# Altium project MASTER_HW.PrjPcb (part 3 of 3)

## Sheet [6] TSAL.SchDoc
size A4; DocumentNumber: 8; SheetNumber: 9; SheetTotal: 10
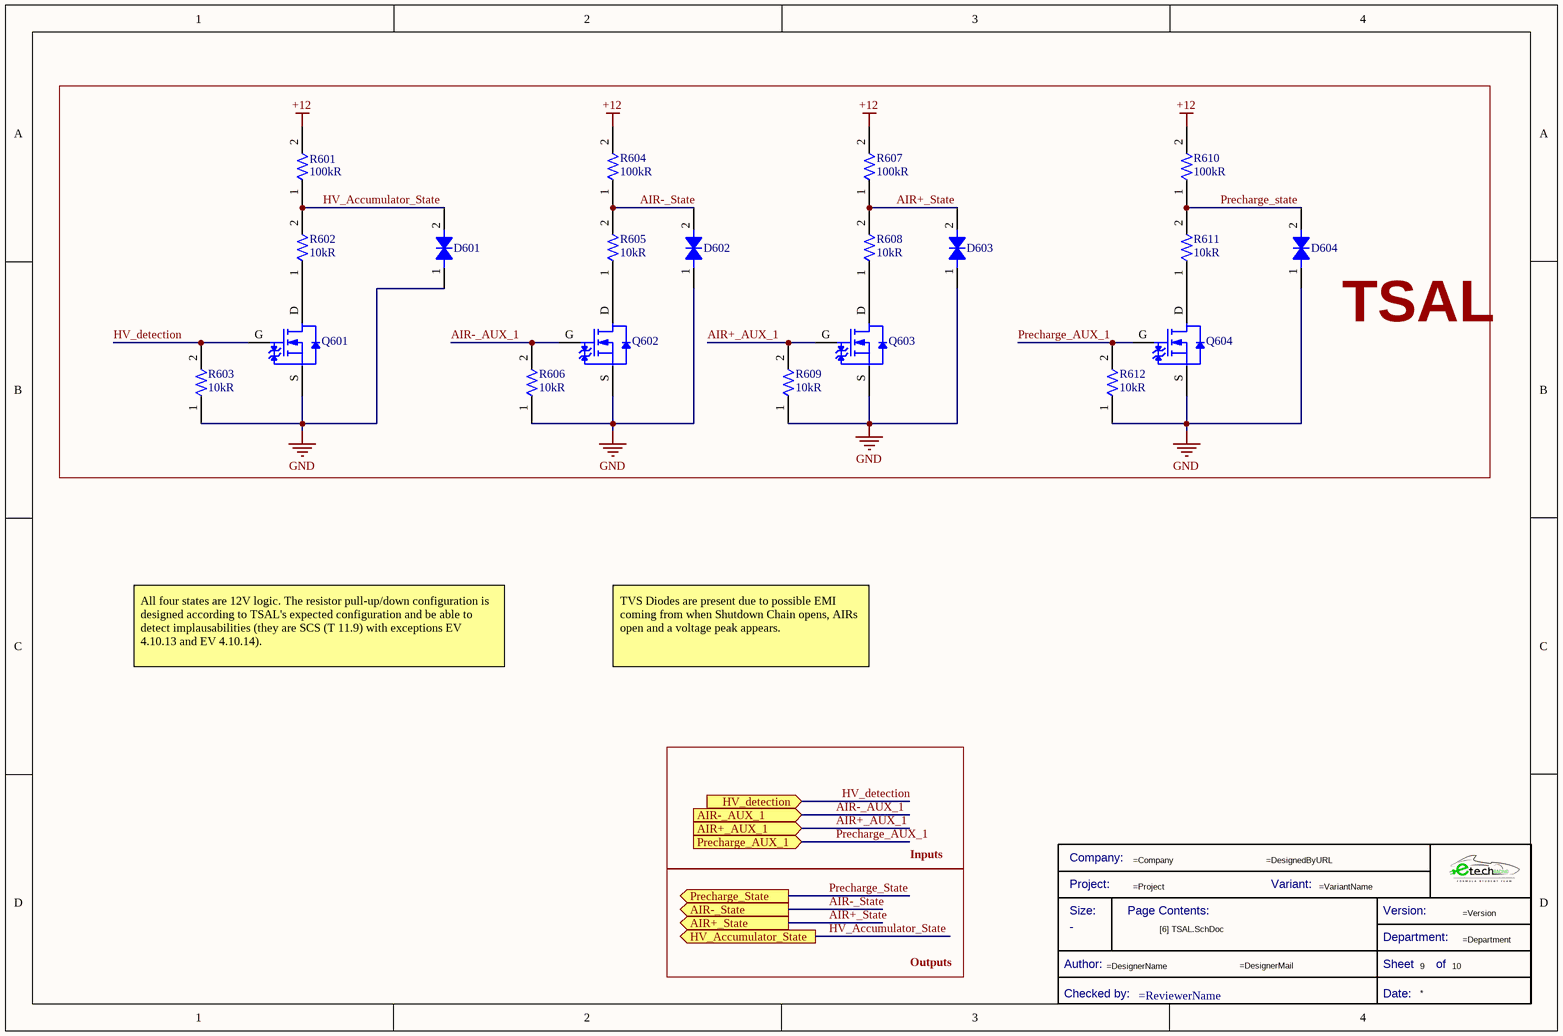
[diagram p4: [6] TSAL.SchDoc]

### Parts
(Parts that share a designator on the sheet are numbered #1, #2 ... from top to bottom, then left to right.)
*?#3  Title Block_template  (value not drawn)  (graphical)
D601  824501131  [DTVS-DO-214AC]  (value not drawn)
D602  824501131  [DTVS-DO-214AC]  (value not drawn)
D603  824501131  [DTVS-DO-214AC]  (value not drawn)
D604  824501131  [DTVS-DO-214AC]  (value not drawn)
Q601  CPH3455-TL-H  [TRT-NCH-3/35-CPH]  (value not drawn)
Q602  CPH3455-TL-H  [TRT-NCH-3/35-CPH]  (value not drawn)
Q603  CPH3455-TL-H  [TRT-NCH-3/35-CPH]  (value not drawn)
Q604  CPH3455-TL-H  [TRT-NCH-3/35-CPH]  (value not drawn)
R601  Resistance: 100kR  [R0805FTK]  (hidden comment: CR0805-JW-103ELF)
R602  Resistance: 10kR  [R0805FTK]  (hidden comment: CR0805-JW-103ELF)
R603  Resistance: 10kR  [R0805FTK]  (hidden comment: CR0805-JW-103ELF)
R604  Resistance: 100kR  [R0805FTK]  (hidden comment: CR0805-JW-103ELF)
R605  Resistance: 10kR  [R0805FTK]  (hidden comment: CR0805-JW-103ELF)
R606  Resistance: 10kR  [R0805FTK]  (hidden comment: CR0805-JW-103ELF)
R607  Resistance: 100kR  [R0805FTK]  (hidden comment: CR0805-JW-103ELF)
R608  Resistance: 10kR  [R0805FTK]  (hidden comment: CR0805-JW-103ELF)
R609  Resistance: 10kR  [R0805FTK]  (hidden comment: CR0805-JW-103ELF)
R610  Resistance: 100kR  [R0805FTK]  (hidden comment: CR0805-JW-103ELF)
R611  Resistance: 10kR  [R0805FTK]  (hidden comment: CR0805-JW-103ELF)
R612  Resistance: 10kR  [R0805FTK]  (hidden comment: CR0805-JW-103ELF)

### Blocks framed on the sheet
TSAL: D601-D604 Q601-Q604 R601-R612

### Ports
AIR+_AUX_1 (in), AIR+_State (out), AIR-_AUX_1 (in), AIR-_State (out), HV_Accumulator_State (out), HV_detection (in), Precharge_AUX_1 (in), Precharge_State (out)

### Nets
+12: R601.2 R604.2 R607.2 R610.2
GND: D601.1 D602.1 D603.1 D604.1 Q601.S Q602.S Q603.S Q604.S R603.1 R606.1 R609.1 R612.1
AIR+_AUX_1: Q603.G R609.2 ; port AIR+_AUX_1
AIR+_State: D603.2 R607.1 R608.2 ; port AIR+_State
AIR-_AUX_1: Q602.G R606.2 ; port AIR-_AUX_1
AIR-_State: D602.2 R604.1 R605.2 ; port AIR-_State
HV_Accumulator_State: D601.2 R601.1 R602.2 ; port HV_Accumulator_State
HV_detection: Q601.G R603.2 ; port HV_detection
Precharge_AUX_1: Q604.G R612.2 ; port Precharge_AUX_1
Precharge_State: D604.2 R610.1 R611.2 ; port Precharge_State
NetQ601_D: Q601.D R602.1
NetQ602_D: Q602.D R605.1
NetQ603_D: Q603.D R608.1
NetQ604_D: Q604.D R611.1

### Notes on the sheet
- All four states are 12V logic. The resistor pull-up/down configuration is designed according to TSAL's expected configuration and be able to detect implausabilities (they are SCS (T 11.9) with exceptions EV 4.10.13 and EV 4.10.14).
- TVS Diodes are present due to possible EMI coming from when Shutdown Chain opens, AIRs open and a voltage peak appears.
- Inputs
- Outputs
- (in symbol Title Block_template) Company:; Project:; Variant:; Size:; Page Contents:; Version:; Department:; Author:; Sheet; of; Checked by:; Date:

### Library data of the parts
*?#3 = Title Block_template: Standard Title Block; Category: Title Block; Checked by:: =ReviewerName; Size: -
D601-D604 = DTVS-13V-DO-214AC: Tvs Diode, 400W, 13V, Bidir, DO-214AC; Manufacturer: Wurth Electronics; Number of Bidirectional Channels: 1; Min Breakdown Voltage: 15.15V; Clamping Voltage: 21.5V; Power Line Protection: No; Polarity: Bidirectional; Peak Pulse Current: 18.6A; .Creator: DO; Supplier 1: Digi-Key; Manufacturer Part Number: 824501131; RoHS: Yes; Category: TVS Diodes; Stock 1: 1000; Pricing 1: 1=0,27000 (USD); Mount: Surface Mount; Number of Pins: 2; Min Operating Temperature: -65°C; Max Operating Temperature: 150°C; Packaging: Cut Tape; Reverse Standoff Voltage: 13V; Peak Pulse Power: 400W; Max Breakdown Voltage: 15.15V; Resistor Type: Zener; REACH SVHC: Unknown; RoHS Compliant: Yes; ComponentLink1URL: https://katalog.we-online.de/pbs/datasheet/824501131.pdf?src-supplier=Digi-Key; ComponentLink1Description: https://katalog.we-online.de/pbs/datasheet/824501131.pdf?src-supplier=Digi-Key; ComponentLink2URL: http://www.farnell.com/datasheets/2036399.pdf?src-supplier=Element14; ComponentLink2Description: http://www.farnell.com/datasheets/2036399.pdf?src-supplier=Element14; ComponentLink3Description: Where buy it; ComponentLink3URL: https://www.we-online.com/catalog/en/WE-TVSP?sq=824501131#824501131; Supplier Part Number 1: 732-824501131CT-ND
Q601-Q604 = TRT-NCH-3/35-CPH: CPH3455-TL-H N-channel MOSFET Transistor; 3 A; 35 V; 3-Pin CPH; Manufacturer: ON Semiconductor; Rds On Max: 104mR; Input Capacitance: 186pF; Rise Time: 4.7ns; Drain to Source Voltage (Vdss): 35V; Continuous Drain Current (ID): 3A; Max Power Dissipation: 1W; Drain to Source Resistance: 108mR; Turn-On Delay Time: 4.2ns; Turn-Off Delay Time: 15ns; Fall Time: 5.7ns; Element Configuration: Single; Gate to Source Voltage (Vgs): 20V; .Creator: GP; Category: Transistor; ComponentLink1Description: Datasheet; ComponentLink1URL: https://docs.rs-online.com/5847/0900766b812d514d.pdf; ComponentLink2Description: Where buy it; ComponentLink2URL: https://es.rs-online.com/web/p/mosfet/8009989; Supplier 1: RSComponents; Manufacturer Part Number: CPH3455-TL-H; RoHS: Yes; Stock 1: 1; Pricing 1: 50=0,50400 (USD); Case/Package: SC; Number of Pins: 3; Min Operating Temperature: -55°C; Max Operating Temperature: 150°C; Package Quantity: 3000; Packaging: Tape and Reel; Drain to Source Breakdown Voltage: 35V; Power Dissipation: 1W; Polarity: N-CHANNEL; Series: -; Length: 2.9mm; Width: 1.6mm; Height: 0.9mm; Lead Free: Lead Free; Halogen Free: Halogen Free; RoHS Compliant: Yes; ComponentLink3URL: https://datasheet.ciiva.com/947/cph3455-d-947201.pdf?src-supplier=Digi-Key; ComponentLink3Description: https://datasheet.ciiva.com/947/cph3455-d-947201.pdf?src-supplier=Digi-Key; ComponentLink4URL: https://datasheet.ciiva.com/4444/cph3455-d-91653-4444616.pdf?src-supplier=Mouser; ComponentLink4Description: https://datasheet.ciiva.com/4444/cph3455-d-91653-4444616.pdf?src-supplier=Mouser; ComponentLink5URL: https://datasheet.ciiva.com/11164/cph3455-d-11164889.pdf?src-supplier=Avnet; ComponentLink5Description: https://datasheet.ciiva.com/11164/cph3455-d-11164889.pdf?src-supplier=Avnet; Supplier Part Number 1: 8009989
R601-R612 = R10k-0805FTK: BOURNS         CR0805-JW-103ELF            Surface Mount Chip Resistor, Thick Film, CR Series, 10 kohm, 125 mW,  5%, 150 V; Temperature Coefficient: 200ppm/°C; Power Rating: 125mW; Voltage Rating: 150V; Voltage Rating (DC): 100V; .Creator: DR; Supplier 1: Arrow Electronics; Manufacturer 1: Bourns; Manufacturer Part Number 1: CR0805-JW-103ELF; RoHS: Yes; Category: Chip SMD Resistors; Stock 1: 57566; Pricing 1: 1=0,05790, 10=0,01540, 25=0,01340, 100=0,00340 (USD); Mount: Surface Mount; Case/Package: 0805; Number of Pins: 2; Contact Plating: Tin; Case Code (Metric): 2012; Case Code (Imperial): 0805; Min Operating Temperature: -55°C; Max Operating Temperature: 155°C; Tolerance: 5%; Resistor Type: Thick Film; Package Quantity: 1; Packaging: Tape and Reel; Number of Terminations: 2; Termination: SMD/SMT; Max Power Dissipation: 125mW; Features: Moisture Resistant; Series: CR0805; Construction: Rectangular; Resistance Tolerance: 5%; Technology: THICK FILM; Length: 2mm; Width: 1.25mm; Height: 0.5mm; Depth: 1.25mm; Thickness: 508um; Radiation Hardening: No; REACH SVHC: No SVHC; Military Standard: Not; RoHS Compliant: Yes; ComponentLink1URL: https://datasheet.ciiva.com/11821/0900766b80fcdb72-11821135.pdf?src-supplier=RSComponents; ComponentLink1Description: https://datasheet.ciiva.com/11821/0900766b80fcdb72-11821135.pdf?src-supplier=RSComponents; ComponentLink2URL: https://datasheet.ciiva.com/9122/chpreztr-9122374.pdf?src-supplier=Avnet; ComponentLink2Description: https://datasheet.ciiva.com/9122/chpreztr-9122374.pdf?src-supplier=Avnet; ComponentLink3URL: https://datasheet.ciiva.com/22693/1902866-22693254.pdf?src-supplier=Element14; ComponentLink3Description: https://datasheet.ciiva.com/22693/1902866-22693254.pdf?src-supplier=Element14; ComponentLink4URL: https://datasheet.ciiva.com/7986/691949-7986187.pdf?src-supplier=Element14; ComponentLink4Description: https://datasheet.ciiva.com/7986/691949-7986187.pdf?src-supplier=Element14; ComponentLink5URL: https://datasheet.ciiva.com/30065/159chpreztr-30065976.pdf?src-supplier=Onlinecomponents.com; ComponentLink5Description: https://datasheet.ciiva.com/30065/159chpreztr-30065976.pdf?src-supplier=Onlinecomponents.com; ComponentLink6URL: https://datasheet.ciiva.com/16783/70154685-16783482.pdf?src-supplier=Allied+Electronics; ComponentLink6Description: https://datasheet.ciiva.com/16783/70154685-16783482.pdf?src-supplier=Allied+Electronics; ComponentLink7URL: https://datasheet.ciiva.com/5548/chpreztr-5548491.pdf?src-supplier=Mouser; ComponentLink7Description: https://datasheet.ciiva.com/5548/chpreztr-5548491.pdf?src-supplier=Mouser; ComponentLink8URL: https://datasheet.ciiva.com/6559/chpreztr-6559900.pdf?src-supplier=Digi-Key; ComponentLink8Description: https://datasheet.ciiva.com/6559/chpreztr-6559900.pdf?src-supplier=Digi-Key; ComponentLink9URL: https://datasheet.ciiva.com/6559/chpreztr-6559901.pdf?src-supplier=Digi-Key; ComponentLink9Description: https://datasheet.ciiva.com/6559/chpreztr-6559901.pdf?src-supplier=Digi-Key; ComponentLink10URL: https://datasheet.ciiva.com/7985/1856384-7985869.pdf?src-supplier=Element14; ComponentLink10Description: https://datasheet.ciiva.com/7985/1856384-7985869.pdf?src-supplier=Element14; ComponentLink11URL: https://datasheet.ciiva.com/48692/001055517-da-01-en-smd-wid-cr0805-jw-103elf-10k-ohm-1-8w-48692118.pdf?src-supplier=Conrad; ComponentLink11Description: https://datasheet.ciiva.com/48692/001055517-da-01-en-smd-wid-cr0805-jw-103elf-10k-ohm-1-8w-48692118.pdf?src-supplier=Conrad; Supplier Part Number 1: CR0805-JW-103ELF

## Sheet [7] Accumulator_Indicator.SchDoc
size A4
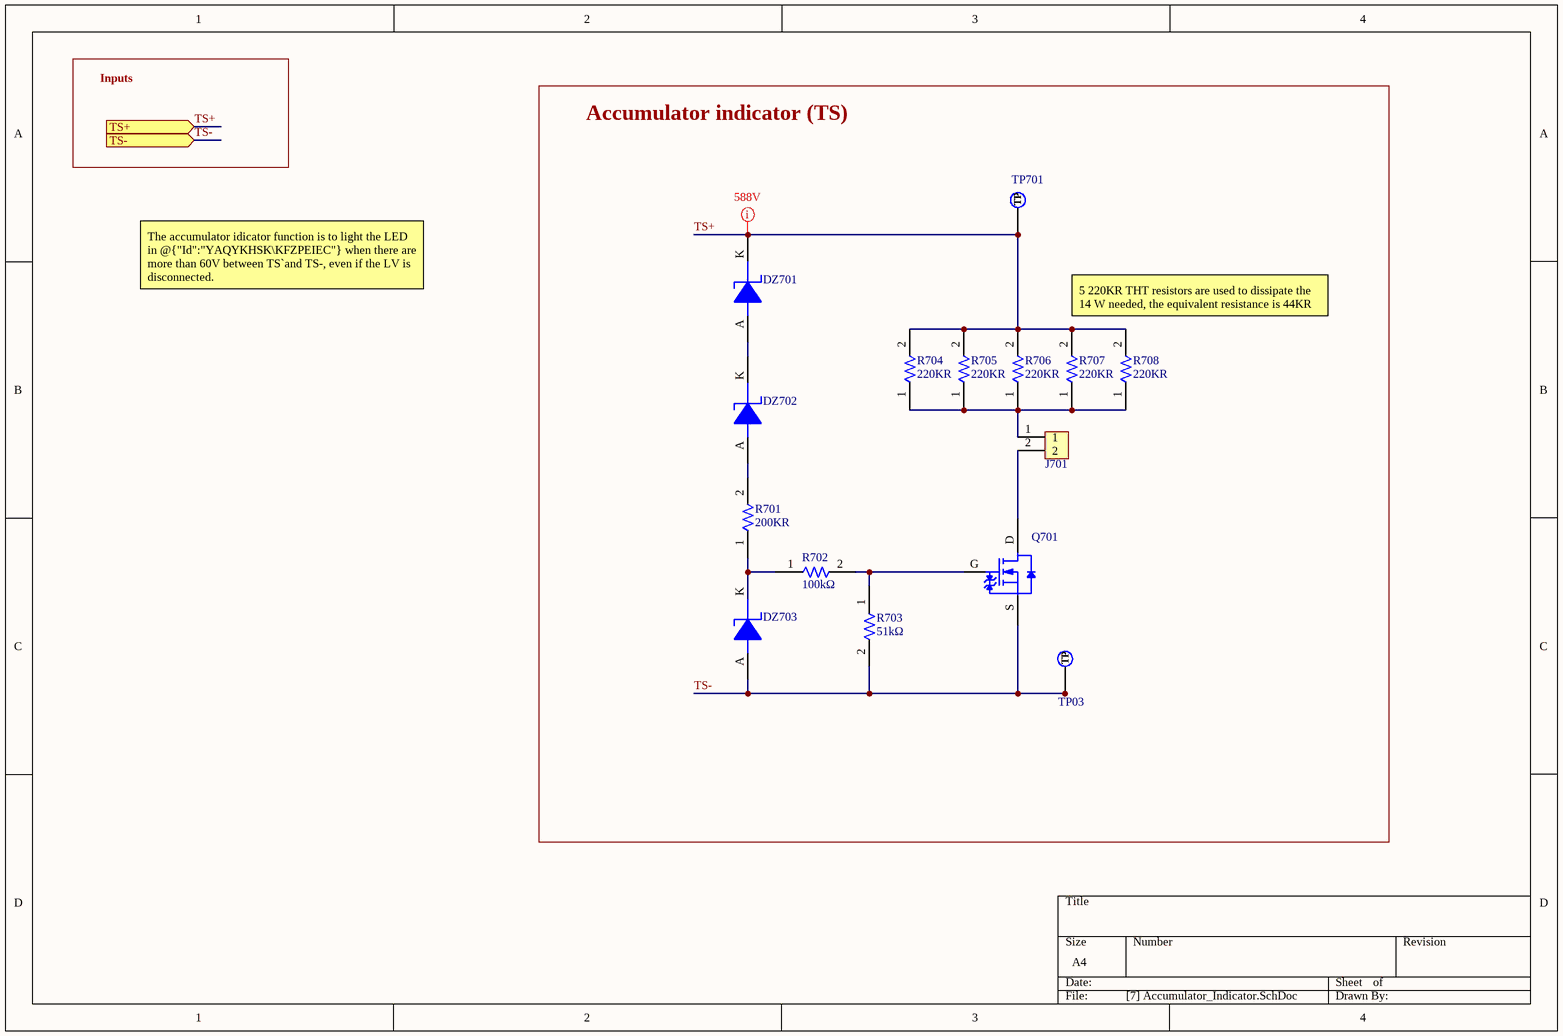
[diagram p5: [7] Accumulator_Indicator.SchDoc]

### Parts
DZ701  DZ_24V  [DZ_SMB-2]  (value not drawn)
DZ702  DZ_24V  [DZ_SMB-2]  (value not drawn)
DZ703  DZ_10V  [SOD123]  (value not drawn)
J701  436500215  [J_MicroFit_2x1]  (value not drawn)
Q701  IRLR2905  [IRLR2905]  (value not drawn)
R701  200KR  [THT_RESISTOR]
R702  Resistance: 100kΩ  [R1206FTK-W]  (hidden comment: CRG1206F100R)
R703  Resistance: 51kΩ  [R1206FTK-W]  (hidden comment: CRCW120610K0FKEA)
R704  220KR  [THT_RESISTOR]
R705  220KR  [THT_RESISTOR]
R706  220KR  [THT_RESISTOR]
R707  220KR  [THT_RESISTOR]
R708  220KR  [THT_RESISTOR]
TP03  TestPoint  [TestPoint]  (value not drawn)  (no BOM)
TP701  TestPoint  [TestPoint]  (value not drawn)  (no BOM)

### Blocks framed on the sheet
Accumulator indicator (TS): DZ701-DZ703 J701 Q701 R701-R708 TP03 TP701

### Ports
TS+ (in), TS- (in)

### Nets
TS+: DZ701.K R704.2 R705.2 R706.2 R707.2 R708.2 TP701.1(TP) ; port TS+
TS-: DZ703.A Q701.S R703.2 TP03.1(TP) ; port TS-
NetDZ701_A: DZ701.A DZ702.K
NetDZ702_A: DZ702.A R701.2
NetDZ703_K: DZ703.K R701.1 R702.1
NetJ701_1: J701.1 R704.1 R705.1 R706.1 R707.1 R708.1
NetJ701_2: J701.2 Q701.D
NetQ701_G: Q701.G R702.2 R703.1

### Layout directives
mark named 588V: TS+

### Notes on the sheet
- Inputs
- The accumulator idicator function is to light the LED in @{"Id":"YAQYKHSK\KFZPEIEC"} when there are more than 60V between TS`and TS-, even if the LV is disconnected.
- 5 220KR THT resistors are used to dissipate the 14 W needed, the equivalent resistance is 44KR

### Library data of the parts
DZ701 DZ702 = DZ_24V: 3.0 W Zener Diode Voltage Regulator 24 V (Automotive); Manufacturer: Diodes; Manufacturer Part Number: BZT52C5V1-7-F; Forward Current: 10mA; Max Power Dissipation: 3W; Tolerance: 5%; Zener Voltage: 24V; Impedance: 19R; Max Reverse Leakage Current: 1uA; RoHS: Yes; Category: Zener Diodes; Stock 1: 2118; Pricing 1: 1=0,79, 10=0,685, 100=0,4743, 500=0,39628, 1000=0,33726 (USD); ComponentLink1URL: https://datasheet.ciiva.com/15142/getdatasheetpartid-75143-15142417.pdf?src-supplier=Verical; ComponentLink1Description: https://datasheet.ciiva.com/15142/getdatasheetpartid-75143-15142417.pdf?src-supplier=Verical; ComponentLink2URL: https://datasheet.ciiva.com/4734/ds18004-73542-4734246.pdf?src-supplier=Mouser; ComponentLink2Description: https://datasheet.ciiva.com/4734/ds18004-73542-4734246.pdf?src-supplier=Mouser; ComponentLink3URL: https://datasheet.ciiva.com/22713/1670962-22713975.pdf?src-supplier=Element14; ComponentLink3Description: https://datasheet.ciiva.com/22713/1670962-22713975.pdf?src-supplier=Element14; Supplier 1: Digi-Key; Case/Package: SMB; Pins: 2; Min Operating Temperature: -65°C; Max Operating Temperature: 150°C; Series: Automotive, AEC-Q101; Packaging: Tape and Reel; Radiation Hardening: No; RoHS Compliant: Yes; Lead Free: Lead Free; Halogen Free: Halogen Free; ComponentLink4URL: https://datasheet.ciiva.com/10638/1smb5913bt3-d-10638009.pdf?src-supplier=Avnet; ComponentLink4Description: https://datasheet.ciiva.com/10638/1smb5913bt3-d-10638009.pdf?src-supplier=Avnet; Supplier Part Number 1: 488-SZ1SMB5934BT3GCT-ND
DZ703 = DZ_10V: BZT52C5V1 Series 500 mW 5.1 V 10 mA Surface Mount Zener Diode - SOD-123; Manufacturer: Diodes; Manufacturer Part Number: BZT52C5V1-7-F; Forward Current: 10mA; Supplier 1: Future Electronics; RoHS: Yes; Category: Zener Diodes; Stock 1: 678000; Pricing 1: 3000=0,0147, 12000=0,0141, 45000=0,0135, 90000=0,0132, 225000=0,0126 (USD); ComponentLink1URL: https://datasheet.ciiva.com/15142/getdatasheetpartid-75143-15142417.pdf?src-supplier=Verical; ComponentLink1Description: https://datasheet.ciiva.com/15142/getdatasheetpartid-75143-15142417.pdf?src-supplier=Verical; ComponentLink2URL: https://datasheet.ciiva.com/4734/ds18004-73542-4734246.pdf?src-supplier=Mouser; ComponentLink2Description: https://datasheet.ciiva.com/4734/ds18004-73542-4734246.pdf?src-supplier=Mouser; ComponentLink3URL: https://datasheet.ciiva.com/22713/1670962-22713975.pdf?src-supplier=Element14; ComponentLink3Description: https://datasheet.ciiva.com/22713/1670962-22713975.pdf?src-supplier=Element14; Supplier Part Number 1: 9109935
J701 = J_MicroFit_2x1: Header 1 Row Vertical Polarizing Peg 2 Pin SMT/Glow Wire Compatible Tin Plate; Manufacturer 1: Molex; Manufacturer Part Number 1: 43650-0215; Supplier 1: Arrow Electronics; RoHS: Yes; Category: Headers and Wire Housings; Stock 1: 11086; Pricing 1: 1=0,87800, 10=0,74400, 80=0,63070, 3264=0,47000, 6528=0,45100, 13056=0,41760 (USD); ComponentLink1URL: https://datasheet.ciiva.com/19462/884109-19462034.pdf?src-supplier=Jameco; ComponentLink1Description: https://datasheet.ciiva.com/19462/884109-19462034.pdf?src-supplier=Jameco; ComponentLink2URL: https://datasheet.ciiva.com/5157/0436500215-pcb-headers-148687-5157608.pdf?src-supplier=Mouser; ComponentLink2Description: https://datasheet.ciiva.com/5157/0436500215-pcb-headers-148687-5157608.pdf?src-supplier=Mouser; ComponentLink3URL: https://datasheet.ciiva.com/16085/0436500215-pcb-headers-16085668.pdf?src-supplier=Onlinecomponents.com; ComponentLink3Description: https://datasheet.ciiva.com/16085/0436500215-pcb-headers-16085668.pdf?src-supplier=Onlinecomponents.com; ComponentLink4URL: https://datasheet.ciiva.com/11748/0900766b80307ce2-11748388.pdf?src-supplier=RSComponents; ComponentLink4Description: https://datasheet.ciiva.com/11748/0900766b80307ce2-11748388.pdf?src-supplier=RSComponents; ComponentLink5URL: https://datasheet.ciiva.com/9432/0436500215-pcb-headers-9432850.pdf?src-supplier=Avnet; ComponentLink5Description: https://datasheet.ciiva.com/9432/0436500215-pcb-headers-9432850.pdf?src-supplier=Avnet; ComponentLink6URL: https://datasheet.ciiva.com/7920/1889390-7920892.pdf?src-supplier=Element14; ComponentLink6Description: https://datasheet.ciiva.com/7920/1889390-7920892.pdf?src-supplier=Element14; Supplier Part Number 1: 43650-0215
Q701 = TRT-NCH-55V-42A: MOSFET N-CH 55V 42A DPAK; Manufacturer 1: Infineon; Manufacturer Part Number 1: IRFR3410TRPBF; Manufacturer Part Number: IRLR2905TRPBF; Continuous Drain Current (ID): 31A; Power Dissipation: 110W; Gate to Source Voltage (Vgs): 20V; Drain to Source Voltage (Vdss): 100V; Rds On Max: 39mR; Input Capacitance: 1.69nF; Max Power Dissipation: 3W; Turn-Off Delay Time: 40ns; Turn-On Delay Time: 12ns; Threshold Voltage: 4V; Polarization: N; ComponentLink2Description: Datasheet; ComponentLink2URL: https://www.mouser.es/datasheet/2/427/sq2318bes-1868475.pdf; RoHS: Yes; Category: MOSFETs; Stock 1: 239; Pricing 1: 1=1,37, 10=1,13, 50=1,13, 100=0,87, 1000=0,615, 10000=0,525 (USD); Mount: Surface Mount; Case/Package: TO-252-3; Number of Pins: 3; Min Operating Temperature: -55°C; Max Operating Temperature: 175°C; Packaging: Cut Tape; Drain to Source Resistance: 39mR; Drain to Source Breakdown Voltage: 100V; Series: HEXFET®; Max Dual Supply Voltage: 100V; Length: 0.264inch; Width: 0.245inch; Height: 0.094inch; Lead Free: Contains Lead; RoHS Compliant: Yes; Reach SVHC Compliant: Yes; Halogen Free: Halogen Free; Supplier 1: Mouser; Manufacturer: Infineon; Supplier Part Number 1: 942-IRLR2905TRPBF
R701 = R_200K_THT
R702 = R100-1206FTK: Res Thick Film 1206 100 Ohm 1% 0.25W(1/4W) ±200ppm/C Pad SMD T/R; Manufacturer: TE Connectivity; Temperature Coefficient: 200ppm/°C; Max Power Dissipation: 250mW; Voltage Rating: 200V; Number of Resistors: 1; .Creator: AC; Category: Resistor; ComponentLink1Description: Datasheet; ComponentLink1URL: https://docs.rs-online.com/7aab/0900766b815b7339.pdf; ComponentLink2Description: Where buy it; ComponentLink2URL: https://es.rs-online.com/web/p/resistencias-de-montaje-en-superficie/2232120; Supplier 1: Digi-Key; Manufacturer Part Number: CRG1206F100R; RoHS: Yes; Stock 1: 13476; Pricing 1: 1=0,10000, 10=0,07600, 100=0,02920, 1000=0,01285, 2500=0,01110 (USD); Mount: Surface Mount; Case/Package: 1206; Case Code (Imperial): 1206; Case Code (Metric): 3216; Weight: 0.000571oz; Min Operating Temperature: -55°C; Max Operating Temperature: 125°C; Tolerance: 1%; Resistor Type: Thick Film; Packaging: Tape and Reel; Package Quantity: 5000; Number of Terminations: 2; Series: CRG, Neohm; Power Rating: 250mW; Termination: Solder; Technology: THICK FILM; Length: 3.1mm; Width: 1.55mm; Height: 0.55mm; Depth: 1.55mm; Radiation Hardening: No; RoHS Compliant: Yes; ELV: Compliant; ComponentLink3URL: https://datasheet.ciiva.com/11808/0900766b800a696e-11808648.pdf?src-supplier=RSComponents; ComponentLink3Description: https://datasheet.ciiva.com/11808/0900766b800a696e-11808648.pdf?src-supplier=RSComponents; ComponentLink4URL: https://datasheet.ciiva.com/16763/70063020-16763547.pdf?src-supplier=Allied+Electronics; ComponentLink4Description: https://datasheet.ciiva.com/16763/70063020-16763547.pdf?src-supplier=Allied+Electronics; ComponentLink5URL: https://datasheet.ciiva.com/5562/eng-ds-1773204-g-5562604.pdf?src-supplier=Mouser; ComponentLink5Description: https://datasheet.ciiva.com/5562/eng-ds-1773204-g-5562604.pdf?src-supplier=Mouser; Supplier Part Number 1: A106068CT-ND
R703 = R51k-1206FTK: Res Thick Film 1206 51K Ohm 1% 1/4W ±100ppm/°C Molded SMD SMD Punched Carrier T/R; Manufacturer: Panasonic; Manufacturer Part Number: ERJ-S08F5102V; Power Rating: 250mW; Voltage Rating: 150V; Voltage Rating (DC): 200V; Current Rating: 2A; .Creator: DO; Category: Resistor; ComponentLink1Description: Datasheet; ComponentLink1URL: https://docs.rs-online.com/bca8/A700000006404581.pdf; ComponentLink2Description: Where buy it; ComponentLink2URL: https://es.rs-online.com/web/p/resistencias-de-montaje-en-superficie/6791765; Supplier 1: Mouser; RoHS: Yes; Stock 1: 4091; Pricing 1: 1=0,31000, 10=0,26700, 50=0,26700, 100=0,10700, 1000=0,05100, 10000=0,03400 (USD); Mount: Surface Mount; Case/Package: 1206; Case Code (Metric): 3216; Case Code (Imperial): 1206; Contact Plating: Tin; Min Operating Temperature: -55°C; Max Operating Temperature: 155°C; Packaging: Tape and Reel; Tolerance: 1%; Package Quantity: 5000; Resistor Type: Thick Film; Number of Terminations: 2; Temperature Coefficient: 100ppm/°C; Max Power Dissipation: 250mW; Features: Anti-Sulfur; Series: ERJ; Construction: Rectangular; Length: 3.2mm; Width: 0.063inch; Height: 0.028inch; Depth: 1.6mm; Military Standard: Not; Lead Free: Lead Free; RoHS Compliant: Yes; ComponentLink3URL: https://datasheet.ciiva.com/24023/aoa0000ce5-24023518.pdf?src-supplier=Mouser; ComponentLink3Description: https://datasheet.ciiva.com/24023/aoa0000ce5-24023518.pdf?src-supplier=Mouser; ComponentLink4URL: https://datasheet.ciiva.com/9189/aoa0000ce5-9189211.pdf?src-supplier=Avnet; ComponentLink4Description: https://datasheet.ciiva.com/9189/aoa0000ce5-9189211.pdf?src-supplier=Avnet; Supplier Part Number 1: 667-ERJ-S08F5102V
R704-R708 = R_220K_THT
TP03 TP701 = TestPoint: Test Point 1x1 mm; .Creator: GP; Category: TestPoint; .PCBcheck: GP; .SCHcheck: GP

## Nets that join several sheets
+12: AMS_Master (5 pins), [3] Shutdown (11 pins), [5] High_Voltage (C501.1 J501.1 L501.1 R506.2), [6] TSAL (R601.2 R604.2 R607.2 R610.2)
GND: AMS_Master (12 pins), [3] Shutdown (12 pins), [5] High_Voltage (C501.2 C502.2 DCDC501.2), [4] Relays_Control (6 pins), [6] TSAL (12 pins)
VCC: AMS_Master (J5.2 J6.1 J7.1), [3] Shutdown (R317.2 R318.2 R319.2)
AIR+_AUX_1: AMS_Master (J10.1), [6] TSAL (Q603.G R609.2)
AIR+_Coil_1: AMS_Master (J1.12 J10.3), [4] Relays_Control (D401.A Q401.D)
AIR+_State: AMS_Master (J1.15), [6] TSAL (D603.2 R607.1 R608.2)
AIR-_AUX_1: AMS_Master (J9.1), [6] TSAL (Q602.G R606.2)
AIR-_Coil_1: AMS_Master (J1.13 J9.3), [4] Relays_Control (D402.A Q402.D)
AIR-_State: AMS_Master (J1.16), [6] TSAL (D602.2 R604.1 R605.2)
AIRMinus_Control: AMS_Master (J4.11 J4.12), [4] Relays_Control (Q402.G R402.2)
AIRPlus_Control: AMS_Master (J4.18), [4] Relays_Control (Q401.G R401.2)
BMS_ERROR: AMS_Master (J6.4), [3] Shutdown (Q301.G R301.1)
HV_Accumulator_State: AMS_Master (J1.10), [6] TSAL (D601.2 R601.1 R602.2)
HV_detection: [5] High_Voltage (U502.4), [6] TSAL (Q601.G R603.2)
IMD_Monitoring: AMS_Master (J6.2), [3] Shutdown (R318.1 U302.14)
IMD_OK_unlatched: AMS_Master (J2.2), [3] Shutdown (R305.2)
Precharge_AUX_1: AMS_Master (J11.1), [6] TSAL (Q604.G R612.2)
Precharge_Coil_1: AMS_Master (J1.11 J11.3), [4] Relays_Control (D403.A Q403.D)
Precharge_Control: AMS_Master (J4.6), [4] Relays_Control (Q403.G R403.2)
Precharge_State: AMS_Master (J1.14), [6] TSAL (D604.2 R610.1 R611.2)
SC_END: AMS_Master (6 pins), [3] Shutdown (U302.10), [4] Relays_Control (D401.K D402.K D403.K)
SC_END_Monitoring: AMS_Master (J4.4), [3] Shutdown (R319.1 U302.13)
SC_IN: AMS_Master (J1.2), [3] Shutdown (X301.5 X301.6)
SC_OUT: AMS_Master (J1.3), [3] Shutdown (U302.8 X302.10)
TS+: [5] High_Voltage (R502.1), [4] Relays_Control (F401.1 J404.1 R404.2 X402.2), [7] Accumulator_Indicator (7 pins)
TS-: [5] High_Voltage (7 pins), [4] Relays_Control (J402.1 X401.2), [7] Accumulator_Indicator (DZ703.A Q701.S R703.2 TP03.1)